# EasyEDA Pro project ProPrj_Practice 4 layer_2025-09-09.epro, schematic Relay Board
Board Name: Relay Board; Create Date: 2025-08-12; Page Name: P1; Project Name: Practice 4 layer; Schematic Name: Relay Board; Update Date: 2025-08-17; Company: EasyEDA.com; Page Size: A4; Version: V1.0
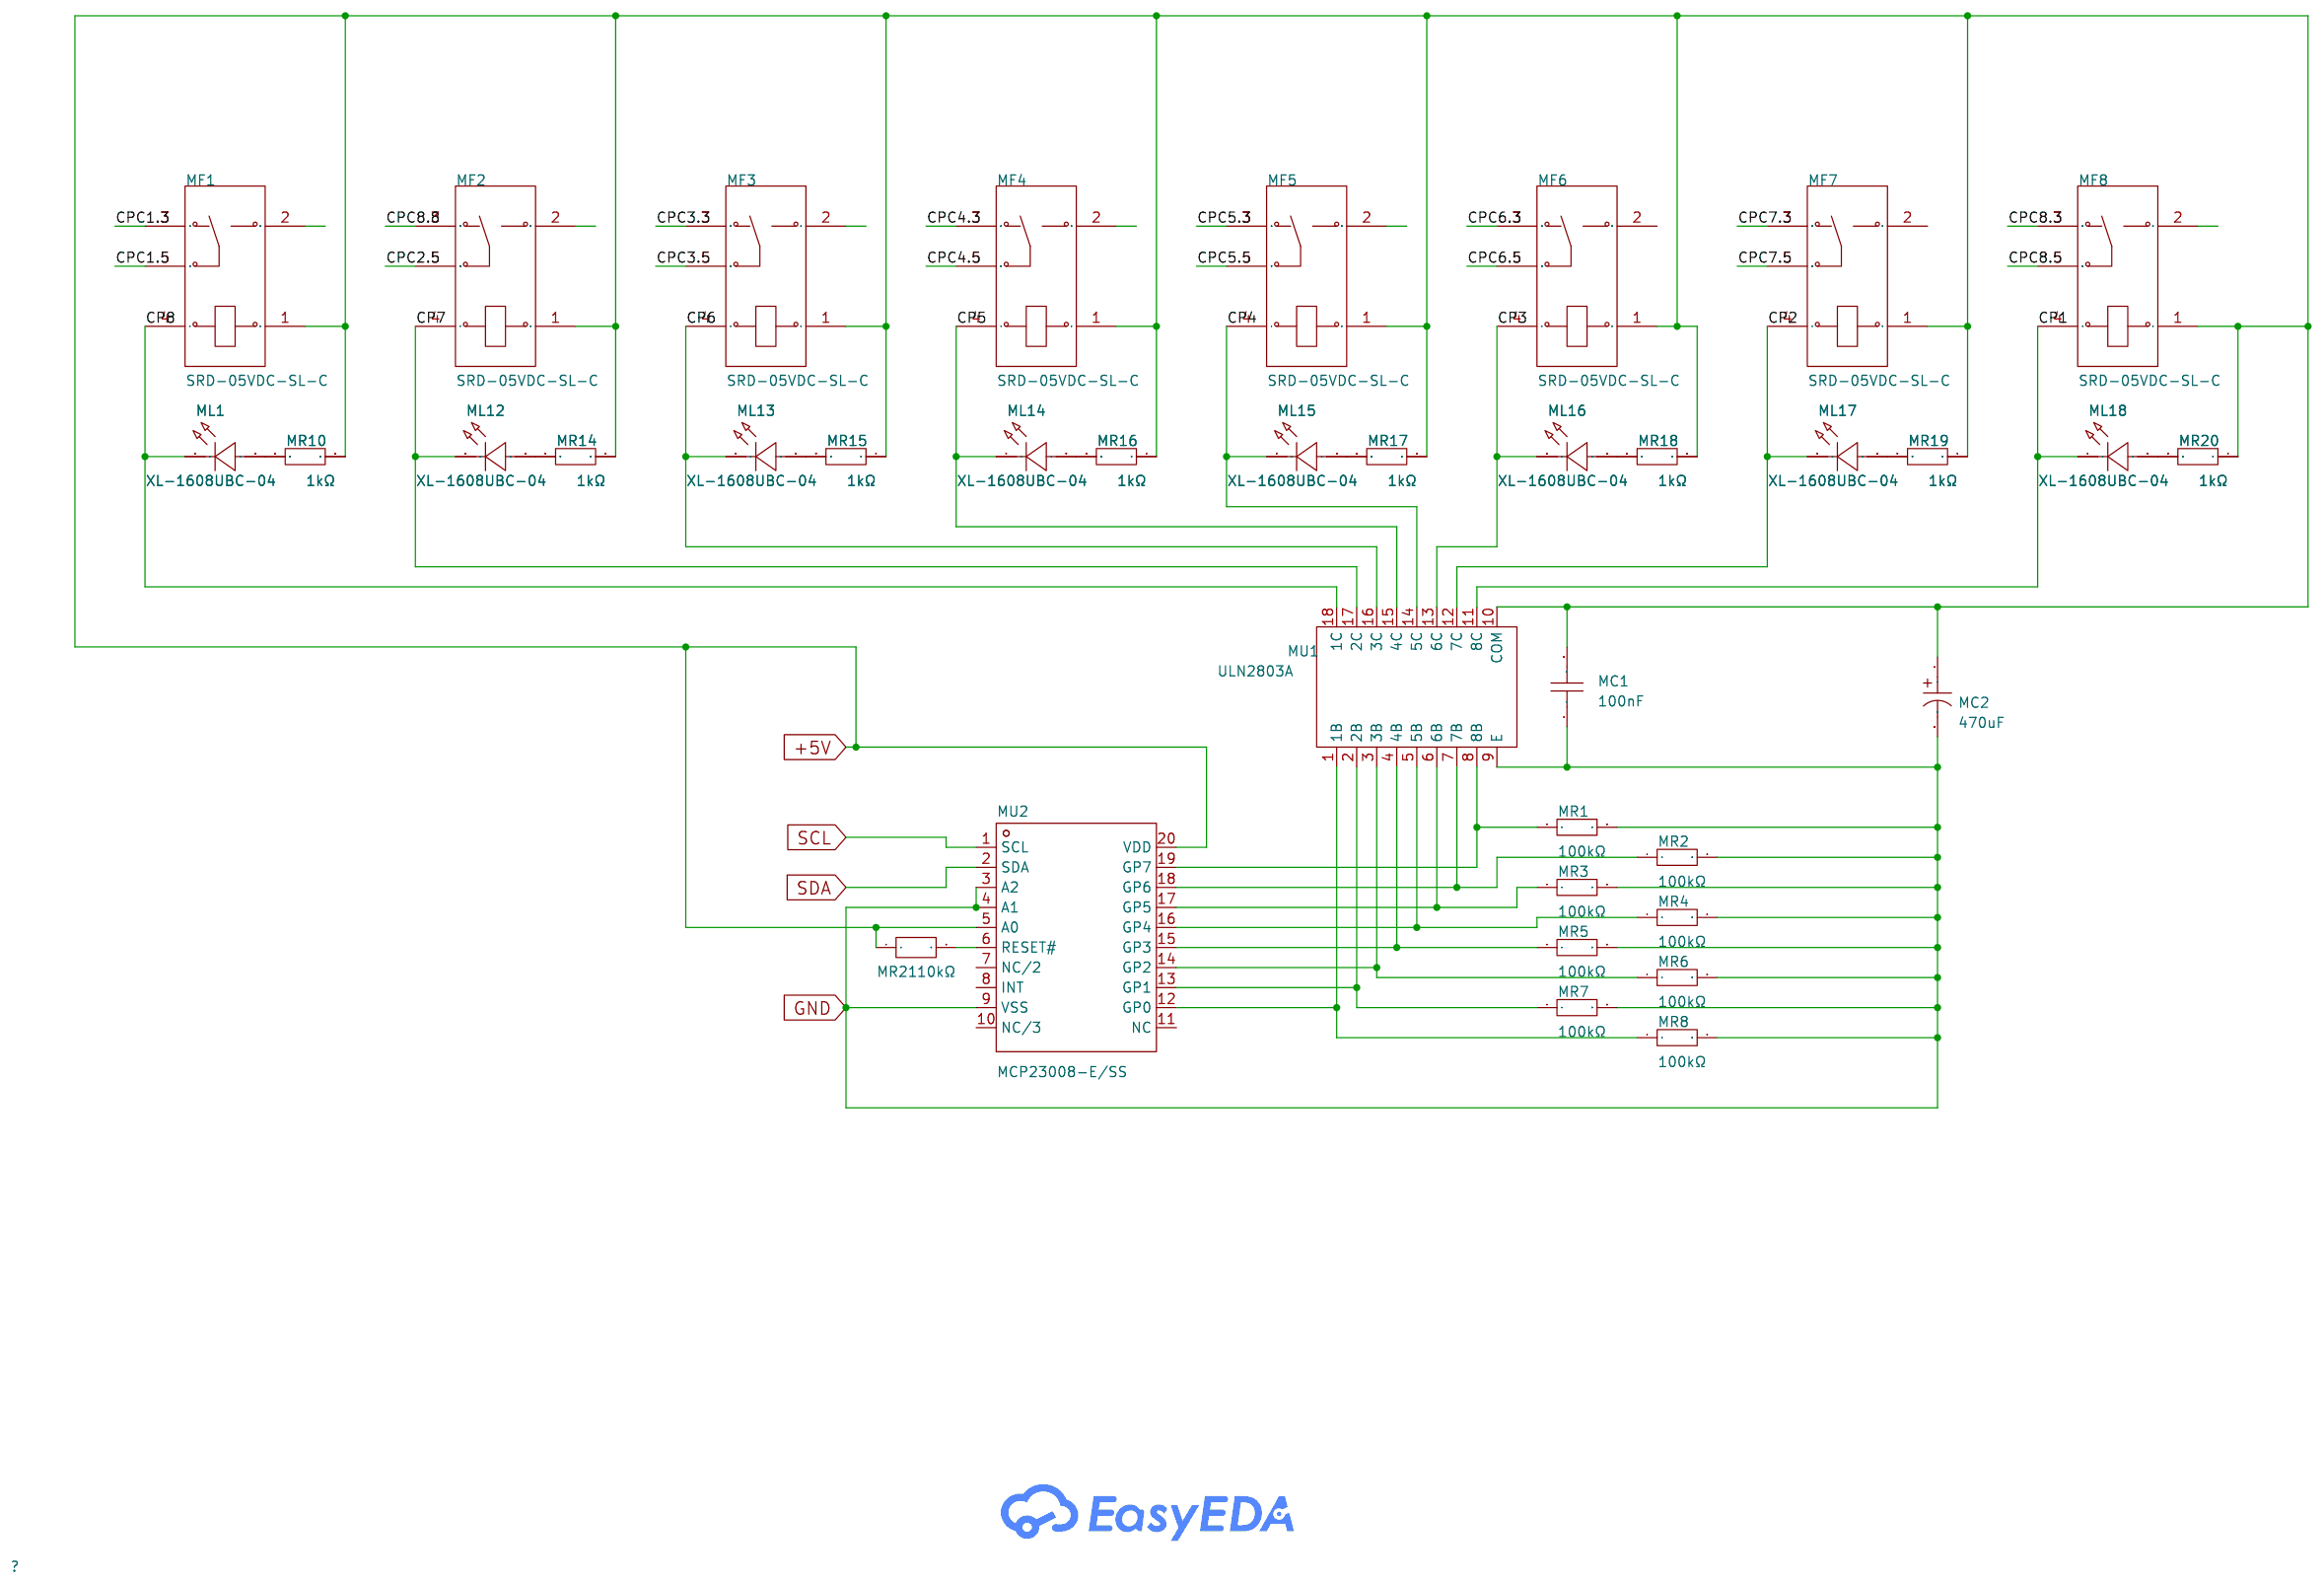
[diagram p3: schematic sheet]

## Parts
MC1  100nF  [C0603]
MC2  470uF  [CAP-SMD_BD6.3-L6.6-W6.6-LS7.6-RD]
MF1  SRD-05VDC-SL-C  [RELAY-TH_SRD-XXVDC-XL-C]  (no BOM)
MF2  SRD-05VDC-SL-C  [RELAY-TH_SRD-XXVDC-XL-C]  (no BOM)
MF3  SRD-05VDC-SL-C  [RELAY-TH_SRD-XXVDC-XL-C]  (no BOM)
MF4  SRD-05VDC-SL-C  [RELAY-TH_SRD-XXVDC-XL-C]  (no BOM)
MF5  SRD-05VDC-SL-C  [RELAY-TH_SRD-XXVDC-XL-C]  (no BOM)
MF6  SRD-05VDC-SL-C  [RELAY-TH_SRD-XXVDC-XL-C]  (no BOM)
MF7  SRD-05VDC-SL-C  [RELAY-TH_SRD-XXVDC-XL-C]  (no BOM)
MF8  SRD-05VDC-SL-C  [RELAY-TH_SRD-XXVDC-XL-C]  (no BOM)
ML1  XL-1608UBC-04  [LED0603-RD_BLUE]
ML12  XL-1608UBC-04  [LED0603-RD_BLUE]
ML13  XL-1608UBC-04  [LED0603-RD_BLUE]
ML14  XL-1608UBC-04  [LED0603-RD_BLUE]
ML15  XL-1608UBC-04  [LED0603-RD_BLUE]
ML16  XL-1608UBC-04  [LED0603-RD_BLUE]
ML17  XL-1608UBC-04  [LED0603-RD_BLUE]
ML18  XL-1608UBC-04  [LED0603-RD_BLUE]
MR1  100kΩ  [R0603]
MR2  100kΩ  [R0603]
MR3  100kΩ  [R0603]
MR4  100kΩ  [R0603]
MR5  100kΩ  [R0603]
MR6  100kΩ  [R0603]
MR7  100kΩ  [R0603]
MR8  100kΩ  [R0603]
MR10  1kΩ  [R0603]
MR14  1kΩ  [R0603]
MR15  1kΩ  [R0603]
MR16  1kΩ  [R0603]
MR17  1kΩ  [R0603]
MR18  1kΩ  [R0603]
MR19  1kΩ  [R0603]
MR20  1kΩ  [R0603]
MR21  10kΩ  [R0603]
MU1  ULN2803A  [SOIC-18_L11.6-W7.5-P1.27-LS10.3-BL]
MU2  MCP23008-E/SS  [SSOP-20_L7.2-W5.3-P0.65-LS7.8-BL]

## Library data of the parts
MC1 = CC0603KRX7R9BB104: Capacitance:100nF Tolerance:±10% Tolerance:±10% Voltage Rating:50V Temperature Coefficient:X7R; LCSC Part Name: 100nF ±10% 50V; Supplier Part: C14663; Manufacturer: YAGEO(国巨); Supplier Footprint: 0603; JLCPCB Part Class: Basic Part; Datasheet: https://atta.szlcsc.com/upload/public/pdf/source/20250214/096C4C206003071F5D32E5F0D8E7F8DF.pdf; Supplier: LCSC; Tolerance: ±10%; Voltage Rating: 50V; Temperature Coefficient: X7R
MC2 = RVT1C471M0607: Capacitance: Tolerance:±20% Tolerance:±20% Voltage Rating: Ripple Current:185mA@120Hz Diameter: Height - Seated (Max): Lifetime:2000hrs@105℃ Operating Temperature:-40℃~+105℃ Operating Temperature:-40℃~+105℃; LCSC Part Name: 470uF ±20% 16V; Supplier Part: C2977552; Manufacturer: ROQANG(容强); Supplier Footprint: SMD,D6.3xL7.7mm; JLCPCB Part Class: Extended Part; Datasheet: https://atta.szlcsc.com/upload/public/pdf/source/20220223/DD822675CC1DF2F0C06D5C2255C9C2D9.pdf; Supplier: LCSC; Tolerance: ±20%; Ripple Current: 185mA@120Hz; Lifetime: 2000hrs@105℃; Operating Temperature: -40℃~+105℃
MF1-MF8 = SRD-05VDC-SL-C: Coil Voltage:5V Contact Form:1 Form C: 1C (SPDT-CO) Number of Pins:5 Contact Rating:- Switching Voltage(Max):250V@AC Coil Rated Power:360mW Switching Current(Max):15A Coil Type:Non-Polarized - Single Coil Coil Resistance:70Ω Contact Resistance:100mΩ Opera; LCSC Part Name: 蓝色 单组转换型继电器; Supplier Part: C35449; Manufacturer: 松乐; Supplier Footprint: 插件,15.6x19.2mm; JLCPCB Part Class: Extended Part; Datasheet: https://item.szlcsc.com/datasheet/SRD-05VDC-SL-C/36422.html; Supplier: LCSC; Coil Voltage: 5V; Contact Form: 1 Form C: 1C (SPDT-CO); Number of Pins: 5; Switching Voltage(Max): 250V@AC; Coil Rated Power: 360mW; Switching Current(Max): 15A; Coil Type: Non-Polarized - Single Coil; Coil Resistance: 70Ω; Contact Resistance: 100mΩ; Operate Time: 10ms; Release Time: 10ms
ML1 ML12-ML18 = XL-1608UBC-04: Lamp Holder Type:- Illumination Color:Blue Voltage - Forward(Vf):3.3V Voltage - Forward(Vf):3.3V Power(Watts):70mW Forward Current:20mA Wavelength - Dominant:455nm~475nm Wavelength - Dominant:455nm~475nm Peak Wavelength:470nm Diode Configuration:- Lens Co; Supplier Part: C965807; Manufacturer: XINGLIGHT(成兴光); Supplier Footprint: 0603; JLCPCB Part Class: Extended Part; Datasheet: https://item.szlcsc.com/datasheet/XL-1608UBC-04/1051416.html; Supplier: LCSC; Illumination Color: Blue; Voltage - Forward(Vf): 3.3V; Power(Watts): 70mW; Forward Current: 20mA; Wavelength - Dominant: 455nm~475nm; Peak Wavelength: 470nm; Lens Color: Water Clear; Luminous Intensity: 300mcd; Viewing Angle: 120°; Mounting Style: op View Mount
MR1-MR8 = 0603WAF1003T5E: Type:Thick Film Resistors Resistance:100kΩ Tolerance:±1% Tolerance:±1% Power(Watts): Overload Voltage (Max): Temperature Coefficient:±100ppm/℃ Temperature Coefficient:±100ppm/℃ Operating Temperature Range:-55℃~+155℃ Operating Temperature Range:-55℃~+155℃; LCSC Part Name: 100kΩ ±1% 100mW 厚膜电阻; Supplier Part: C25803; Manufacturer: UNI-ROYAL(厚声); Supplier Footprint: 0603; JLCPCB Part Class: Basic Part; Datasheet: https://atta.szlcsc.com/upload/public/pdf/source/20200306/C422600_1E6D84923E4A46A82E41ADD87F860B5C.pdf; Supplier: LCSC; Type: Thick Film Resistors; Tolerance: ±1%; Temperature Coefficient: ±100ppm/℃; Operating Temperature Range: -55℃~+155℃
MR10 MR14-MR20 = 0603WAF1001T5E: Type:Thick Film Resistors Resistance:1kΩ Tolerance:±1% Tolerance:±1% Power(Watts): Overload Voltage (Max): Temperature Coefficient:±100ppm/℃ Temperature Coefficient:±100ppm/℃ Operating Temperature Range:-55℃~+155℃ Operating Temperature Range:-55℃~+155℃; LCSC Part Name: 1kΩ ±1% 100mW 厚膜电阻; Supplier Part: C21190; Manufacturer: UNI-ROYAL(厚声); Supplier Footprint: 0603; JLCPCB Part Class: Basic Part; Datasheet: https://atta.szlcsc.com/upload/public/pdf/source/20200306/C422600_1E6D84923E4A46A82E41ADD87F860B5C.pdf; Supplier: LCSC; Type: Thick Film Resistors; Tolerance: ±1%; Temperature Coefficient: ±100ppm/℃; Operating Temperature Range: -55℃~+155℃
MR21 = FRC0603J103 TS: Type:Thick Film Resistors Resistance:10kΩ Tolerance:±5% Tolerance:±5% Power(Watts):0.1W Voltage-Supply(Max):75V Temperature Coefficient:±100ppm/℃ Temperature Coefficient:±100ppm/℃ Operating Temperature:-55℃~+155℃ Operating Temperature:-55℃~+155℃; LCSC Part Name: 10kΩ ±5% 100mW 厚膜电阻; Supplier Part: C2930027; Manufacturer: FOJAN(富捷); Supplier Footprint: 0603; JLCPCB Part Class: Extended Part; Datasheet: https://atta.szlcsc.com/upload/public/pdf/source/20211221/925EC7D7225764EE0046F22065062C87.pdf; Supplier: LCSC; Type: Thick Film Resistors; Tolerance: ±5%; Power(Watts): 0.1W; Voltage-Supply(Max): 75V; Temperature Coefficient: ±100ppm/℃; Operating Temperature: -55℃~+155℃
MU1 = ULN2803A_C181731: number of channels:Eight channels Maximum collector Emitter Voltage (Vceo):50V Collector Current(Ic):500mA maximum input voltage:30V Operating Temperature:-40℃~+85℃ Operating Temperature:-40℃~+85℃; Supplier Part: C181731; Manufacturer: Mixic(中科芯亿达); Supplier Footprint: SOIC-18-300mil; JLCPCB Part Class: Extended Part; Datasheet: https://atta.szlcsc.com/upload/public/pdf/source/20180207/C181731_15179898068571356493.pdf; Supplier: LCSC; number of channels: Eight channels; Maximum collector Emitter Voltage (Vceo): 50V; Collector Current(Ic): 500mA; maximum input voltage: 30V; Operating Temperature: -40℃~+85℃
MU2 = MCP23008-E/SS: Interface:I2C Number of I/O:8 Interrupt Output:With Interrupt Output Output Type: Supply Voltage:- Supply Voltage:- Output Source current:- Output Sink Current:- Clock Frequency:1.7MHz Operating Temperature:- Operating Temperature:-; LCSC Part Name: 8位I/O扩展器带串行接口; Supplier Part: C148011; Manufacturer: MICROCHIP(美国微芯); Supplier Footprint: SSOP-20-208mil; JLCPCB Part Class: Extended Part; Datasheet: https://atta.szlcsc.com/upload/public/pdf/source/20171228/C152205_15144475388971215001.pdf; Supplier: LCSC; Interface: I2C; Number of I/O: 8; Interrupt Output: With Interrupt Output; Clock Frequency: 1.7MHz

## Nets
+5V: MC1.2 MC2.1 MF1.1 MF2.1 MF3.1 MF4.1 MF5.1 MF6.1 MF7.1 MF8.1 MR10.1 MR14.1 MR15.1 MR16.1 MR17.1 MR18.1 MR19.1 MR20.1 MR21.1 MU1.10(COM) MU2.5(A0) MU2.20(VDD)
GND: MC1.1 MC2.2 MR1.2 MR2.2 MR3.2 MR4.2 MR5.2 MR6.2 MR7.2 MR8.2 MU1.9(E) MU2.3(A2) MU2.4(A1) MU2.9(VSS)
CP1: MF8.4 ML18.1(K) MU1.11(8C)
CP2: MF7.4 ML17.1(K) MU1.12(7C)
CP3: MF6.4 ML16.1(K) MU1.13(6C)
CP4: MF5.4 ML15.1(K) MU1.14(5C)
CP5: MF4.4 ML14.1(K) MU1.15(4C)
CP6: MF3.4 ML13.1(K) MU1.16(3C)
CP7: MF2.4 ML12.1(K) MU1.17(2C)
CP8: MF1.4 ML1.1(K) MU1.18(1C)
CPC1.3: MF1.3
CPC1.5: MF1.5
CPC2.5: MF2.5
CPC3.3: MF3.3
CPC3.5: MF3.5
CPC4.3: MF4.3
CPC4.5: MF4.5
CPC5.3: MF5.3
CPC5.5: MF5.5
CPC6.3: MF6.3
CPC6.5: MF6.5
CPC7.3: MF7.3
CPC7.5: MF7.5
CPC8.3: MF8.3
CPC8.5: MF8.5
CPC8.8: MF2.3
SCL: MU2.1(SCL)
SDA: MU2.2(SDA)
$1N4928: ML1.2(A) MR10.2
$1N5035: ML13.2(A) MR15.2
$1N5037: ML12.2(A) MR14.2
$1N5083: ML14.2(A) MR16.2
$1N5129: ML15.2(A) MR17.2
$1N5175: ML16.2(A) MR18.2
$1N5221: ML17.2(A) MR19.2
$1N5267: ML18.2(A) MR20.2
$1N6656: MR8.1 MU1.1(1B) MU2.12(GP0)
$1N6661: MR7.1 MU1.2(2B) MU2.13(GP1)
$1N6667: MR6.1 MU1.3(3B) MU2.14(GP2)
$1N6673: MR5.1 MU1.4(4B) MU2.15(GP3)
$1N6685: MR3.1 MU1.6(6B) MU2.17(GP5)
$1N6691: MR2.1 MU1.7(7B) MU2.18(GP6)
$1N6697: MR1.1 MU1.8(8B) MU2.19(GP7)
$1N6767: MR4.1 MU1.5(5B) MU2.16(GP4)
$1N7396: MR21.2 MU2.6(RESET#)

Not connected (* = marked no-connect by the designer): MF1 2; MF2 2; MF3 2; MF4 2; MF5 2; MF6 2; MF7 2; MF8 2; MU2 7(NC/2) 8(INT) 10(NC/3) 11(NC)
